# Altium schematic sheet usb_dc_converter.SchDoc
size 400 x 379 mm; SheetNumber: 2; SheetTotal: 13
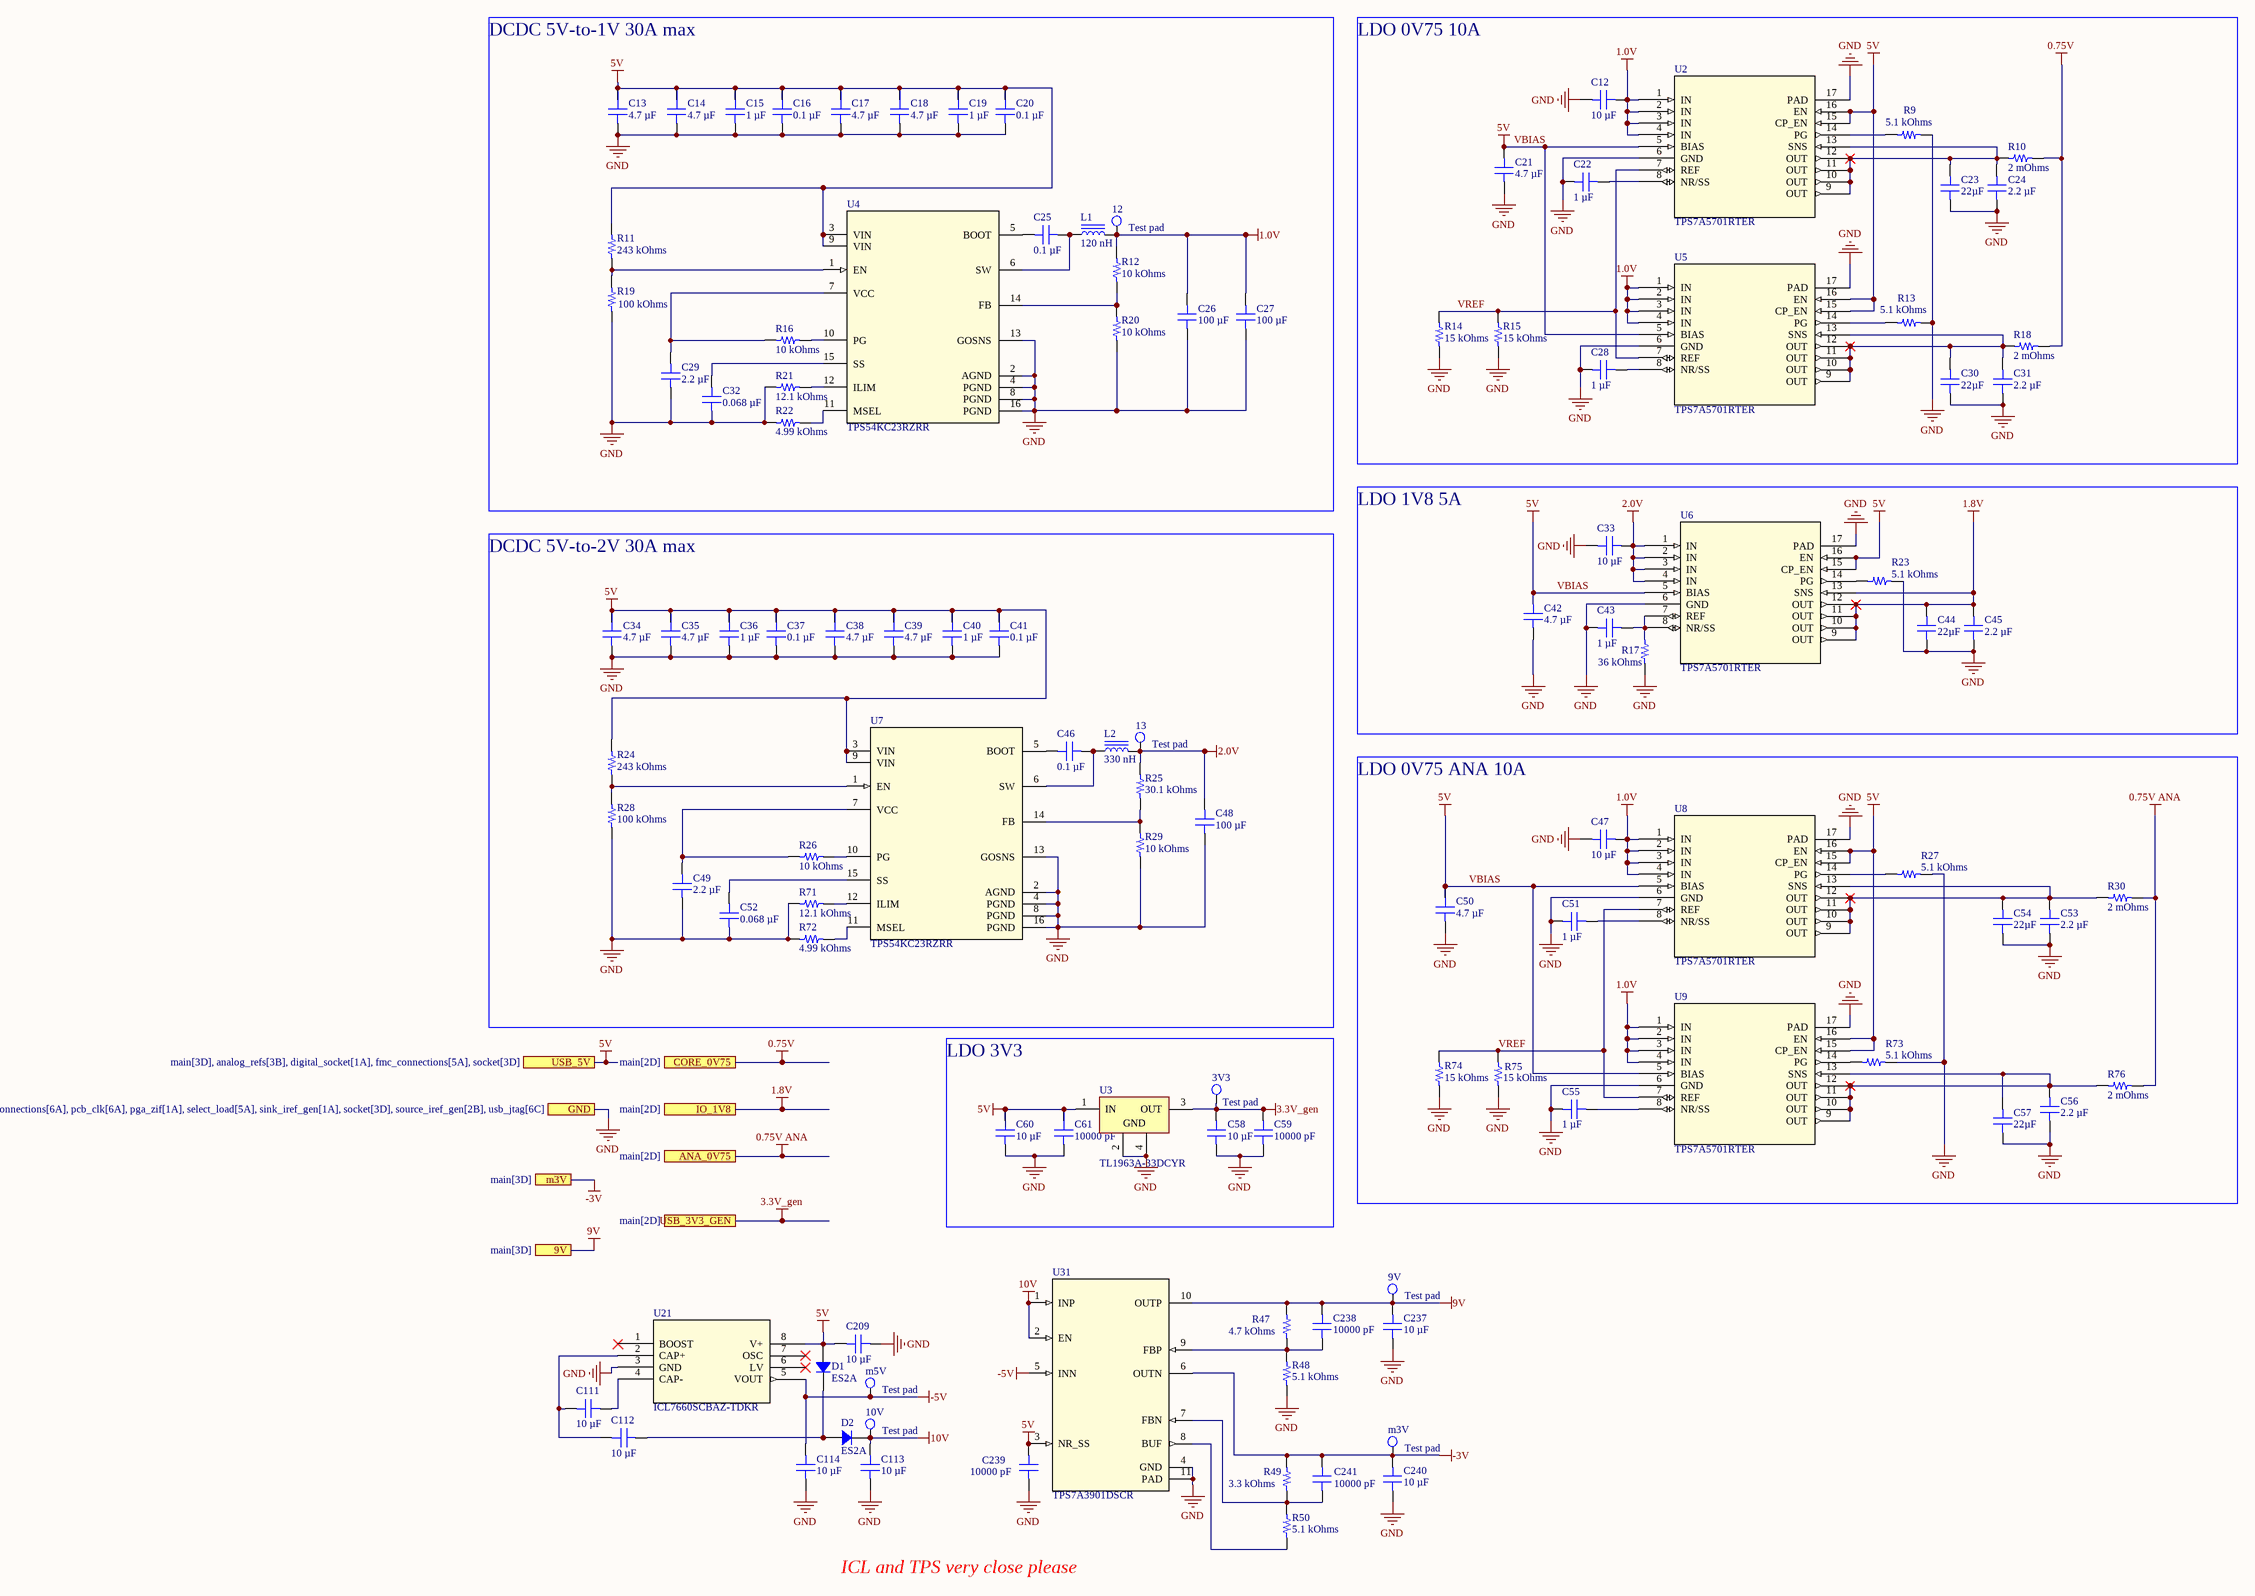
[diagram p0: usb_dc_converter.SchDoc]

## Parts
3V3  Test pad  [Test Pad]
9V  Test pad  [Test Pad]
10V  Test pad  [Test Pad]
12  Test pad  [Test Pad]
13  Test pad  [Test Pad]
C12  10 µF  [CAP 0805_2012]
C13  4.7 µF  [CAP 0805_2012]
C14  4.7 µF  [CAP 0805_2012]
C15  1 µF  [CAP 0805_2012]
C16  0.1 µF  [CAP 0805_2012]
C17  4.7 µF  [CAP 0805_2012]
C18  4.7 µF  [CAP 0805_2012]
C19  1 µF  [CAP 0805_2012]
C20  0.1 µF  [CAP 0805_2012]
C21  4.7 µF  [CAP 0805_2012]
C22  1 µF  [CAP 0805_2012]
C23  22µF  [CAP 0805_2012]
C24  2.2 µF  [CAP 0805_2012]
C25  0.1 µF  [CAP 0805_2012]
C26  100 µF  [CAP 0805_2012]
C27  100 µF  [CAP 0805_2012]
C28  1 µF  [CAP 0805_2012]
C29  2.2 µF  [CAP 0805_2012]
C30  22µF  [CAP 0805_2012]
C31  2.2 µF  [CAP 0805_2012]
C32  0.068 µF  [CAP 0805_2012]
C33  10 µF  [CAP 0805_2012]
C34  4.7 µF  [CAP 0805_2012]
C35  4.7 µF  [CAP 0805_2012]
C36  1 µF  [CAP 0805_2012]
C37  0.1 µF  [CAP 0805_2012]
C38  4.7 µF  [CAP 0805_2012]
C39  4.7 µF  [CAP 0805_2012]
C40  1 µF  [CAP 0805_2012]
C41  0.1 µF  [CAP 0805_2012]
C42  4.7 µF  [CAP 0805_2012]
C43  1 µF  [CAP 0805_2012]
C44  22µF  [CAP 0805_2012]
C45  2.2 µF  [CAP 0805_2012]
C46  0.1 µF  [CAP 0805_2012]
C47  10 µF  [CAP 0805_2012]
C48  100 µF  [CAP 0805_2012]
C49  2.2 µF  [CAP 0805_2012]
C50  4.7 µF  [CAP 0805_2012]
C51  1 µF  [CAP 0805_2012]
C52  0.068 µF  [CAP 0805_2012]
C53  2.2 µF  [CAP 0805_2012]
C54  22µF  [CAP 0805_2012]
C55  1 µF  [CAP 0805_2012]
C56  2.2 µF  [CAP 0805_2012]
C57  22µF  [CAP 0805_2012]
C58  10 µF  [CAP 0805_2012]
C59  10000 pF  [CAP 0805_2012]
C60  10 µF  [CAP 0805_2012]
C61  10000 pF  [CAP 0805_2012]
C111  10 µF  [CAP 0805_2012]
C112  10 µF  [CAP 0805_2012]
C113  10 µF  [CAP 0805_2012]
C114  10 µF  [CAP 0805_2012]
C209  10 µF  [CAP 0805_2012]
C237  10 µF  [CAP 0805_2012]
C238  10000 pF  [CAP 0805_2012]
C239  10000 pF  [CAP 0805_2012]
C240  10 µF  [CAP 0805_2012]
C241  10000 pF  [CAP 0805_2012]
D1  ES2A  [DO214AA SMB]
D2  ES2A  [DO214AA SMB]
L1  120 nH  [IND 0201_0603]
L2  330 nH  [Murata LQW15 0402]
m3V  Test pad  [Test Pad]
m5V  Test pad  [Test Pad]
R9  5.1 kOhms  [RES 0805_2012]
R10  2 mOhms  [RES 0805_2012]
R11  243 kOhms  [RES 0805_2012]
R12  10 kOhms  [RES 0805_2012]
R13  5.1 kOhms  [RES 0805_2012]
R14  15 kOhms  [RES 0805_2012]
R15  15 kOhms  [RES 0805_2012]
R16  10 kOhms  [RES 0805_2012]
R17  36 kOhms  [RES 0805_2012]
R18  2 mOhms  [RES 0805_2012]
R19  100 kOhms  [RES 0805_2012]
R20  10 kOhms  [RES 0805_2012]
R21  12.1 kOhms  [RES 0805_2012]
R22  4.99 kOhms  [RES 0805_2012]
R23  5.1 kOhms  [RES 0805_2012]
R24  243 kOhms  [RES 0805_2012]
R25  30.1 kOhms  [RES 0805_2012]
R26  10 kOhms  [RES 0805_2012]
R27  5.1 kOhms  [RES 0805_2012]
R28  100 kOhms  [RES 0805_2012]
R29  10 kOhms  [RES 0805_2012]
R30  2 mOhms  [RES 0805_2012]
R47  4.7 kOhms  [YAGEO RES 0805_2012]
R48  5.1 kOhms  [RES 0805_2012]
R49  3.3 kOhms  [YAGEO RES 0805_2012]
R50  5.1 kOhms  [RES 0805_2012]
R71  12.1 kOhms  [RES 0805_2012]
R72  4.99 kOhms  [RES 0805_2012]
R73  5.1 kOhms  [RES 0805_2012]
R74  15 kOhms  [RES 0805_2012]
R75  15 kOhms  [RES 0805_2012]
R76  2 mOhms  [RES 0805_2012]
U2  TPS7A5701RTER  [WQFN16_RTE_TEX_THERMAL]
U3  TL1963A-33DCYR  [DCY0004A_N]
U4  TPS54KC23RZRR  [RZR0016A-MFG_THERMAL]
U5  TPS7A5701RTER  [WQFN16_RTE_TEX_THERMAL]
U6  TPS7A5701RTER  [WQFN16_RTE_TEX_THERMAL]
U7  TPS54KC23RZRR  [RZR0016A-MFG_THERMAL]
U8  TPS7A5701RTER  [WQFN16_RTE_TEX_THERMAL]
U9  TPS7A5701RTER  [WQFN16_RTE_TEX_THERMAL]
U21  ICL7660SCBAZ-TDKR  [SOIC8_4X5_INR]
U31  TPS7A3901DSCR  [DSC0010J]

## Blocks framed on the sheet
DCDC 5V-to-1V 30A max: 12 C13-C20 C25-C27 C29 C32 L1 R11 R12 R16 R19-R22 U4
LDO 0V75 10A: C12 C21-C24 C28 C30 C31 R9 R10 R13-R15 R18 U2 U5
DCDC 5V-to-2V 30A max: 13 C34-C41 C46 C48 C49 C52 L2 R24-R26 R28 R29 R71 R72 U7
LDO 1V8 5A: C33 C42-C45 R17 R23 U6
LDO 0V75 ANA 10A: C47 C50 C51 C53-C57 R27 R30 R73-R76 U8 U9
LDO 3V3: 3V3 C58-C61 U3

## Ports
9V (see main[3D]), ANA_0V75 (see main[2D]), CORE_0V75 (see main[2D]), GND (see main[3D], analog_refs[3B], digital_socket[1A], fmc_connections[6A], pcb_clk[6A], pga_zif[1A], select_load[5A], sink_iref_gen[1A], socket[3D], source_iref_gen[2B], usb_jtag[6C]), IO_1V8 (see main[2D]), m3V (see main[3D]), USB_3V3_GEN (see main[2D]), USB_5V (see main[3D], analog_refs[3B], digital_socket[1A], fmc_connections[5A], socket[3D])

## Nets
0.75V: R10.2 R18.2 ; port CORE_0V75
0.75V ANA: R30.2 R76.2 ; port ANA_0V75
1.0V: 12.1 C12.1 C26.2 C27.2 C47.1 L1.2 R12.2 U2.1(IN) U2.2(IN) U2.3(IN) U2.4(IN) U5.1(IN) U5.2(IN) U5.3(IN) U5.4(IN) U8.1(IN) U8.2(IN) U8.3(IN) U8.4(IN) U9.1(IN) U9.2(IN) U9.3(IN) U9.4(IN)
1.8V: C44.2 C45.2 U6.9(OUT) U6.10(OUT) U6.11(OUT) U6.12(OUT) U6.13(SNS) ; port IO_1V8
2.0V: 13.1 C33.1 C48.2 L2.2 R25.2 U6.1(IN) U6.2(IN) U6.3(IN) U6.4(IN)
3.3V_gen: 3V3.1 C58.2 C59.2 U3.3(OUT) ; port USB_3V3_GEN
9V: 9V.1 C237.2 C238.2 R47.2 U31.10(OUTP) ; port 9V
10V: 10V.1 C113.2 D2.2 U31.1(INP) U31.2(EN)
-3V: C240.2 C241.2 m3V.1 R49.2 U31.6(OUTN) ; port m3V
-5V: C114.2 m5V.1 U21.5(VOUT) U31.5(INN)
GND: C12.2 C13.1 C14.1 C15.1 C16.1 C17.1 C18.1 C19.1 C20.1 C21.1 C22.2 C23.1 C24.1 C26.1 C27.1 C28.2 C29.1 C30.1 C31.1 C32.1 C33.2 C34.1 C35.1 C36.1 C37.1 C38.1 C39.1 C40.1 C41.1 C42.1 C43.2 C44.1 C45.1 C47.2 C48.1 C49.1 C50.1 C51.2 C52.1 C53.1 C54.1 C55.2 C56.1 C57.1 C58.1 C59.1 C60.1 C61.1 C113.1 C114.1 C209.1 C237.1 C239.1 C240.1 R9.1 R13.1 R14.1 R15.1 R17.1 R19.1 R20.1 R21.1 R22.1 R23.1 R27.1 R28.1 R29.1 R48.1 R71.1 R72.1 R73.1 R74.1 R75.1 U2.6(GND) U2.17(PAD) U3.2(GND) U3.4(GND) U4.2(AGND) U4.4(PGND) U4.8(PGND) U4.13(GOSNS) U4.16(PGND) U5.6(GND) U5.17(PAD) U6.6(GND) U6.17(PAD) U7.2(AGND) U7.4(PGND) U7.8(PGND) U7.13(GOSNS) U7.16(PGND) U8.6(GND) U8.17(PAD) U9.6(GND) U9.17(PAD) U21.3(GND) U31.4(GND) U31.11(PAD) ; port GND
VBIAS: C13.2 C14.2 C15.2 C16.2 C17.2 C18.2 C19.2 C20.2 C21.2 C34.2 C35.2 C36.2 C37.2 C38.2 C39.2 C40.2 C41.2 C42.2 C50.2 C60.2 C61.2 C209.2 C239.2 D1.1 R11.2 R24.2 U2.5(BIAS) U2.15(CP_EN) U2.16(EN) U3.1(IN) U4.3(VIN) U4.9(VIN) U5.5(BIAS) U5.15(CP_EN) U5.16(EN) U6.5(BIAS) U6.15(CP_EN) U6.16(EN) U7.3(VIN) U7.9(VIN) U8.5(BIAS) U8.15(CP_EN) U8.16(EN) U9.5(BIAS) U9.15(CP_EN) U9.16(EN) U21.8(V+) U31.3(NR_SS) ; port USB_5V  [also labelled 5V]
VREF: R14.2 R15.2 R74.2 R75.2 U2.7(REF) U5.7(REF) U8.7(REF) U9.7(REF)
NetC22_1: C22.1 U2.8(NR/SS)
NetC23_2: C23.2 C24.2 R10.1 U2.9(OUT) U2.10(OUT) U2.11(OUT) U2.12(OUT) U2.13(SNS)
NetC25_1: C25.1 L1.1 U4.6(SW)
NetC25_2: C25.2 U4.5(BOOT)
NetC28_1: C28.1 U5.8(NR/SS)
NetC29_2: C29.2 R16.1 U4.7(VCC)
NetC30_2: C30.2 C31.2 R18.1 U5.9(OUT) U5.10(OUT) U5.11(OUT) U5.12(OUT) U5.13(SNS)
NetC32_2: C32.2 U4.15(SS)
NetC43_1: C43.1 R17.2 U6.7(REF) U6.8(NR/SS)
NetC46_1: C46.1 L2.1 U7.6(SW)
NetC46_2: C46.2 U7.5(BOOT)
NetC49_2: C49.2 R26.2 U7.7(VCC)
NetC51_1: C51.1 U8.8(NR/SS)
NetC52_2: C52.2 U7.15(SS)
NetC53_2: C53.2 C54.2 R30.1 U8.9(OUT) U8.10(OUT) U8.11(OUT) U8.12(OUT) U8.13(SNS)
NetC55_1: C55.1 U9.8(NR/SS)
NetC56_2: C56.2 C57.2 R76.1 U9.9(OUT) U9.10(OUT) U9.11(OUT) U9.12(OUT) U9.13(SNS)
NetC111_1: C111.1 U21.4(CAP-)
NetC111_2: C111.2 C112.1 U21.2(CAP+)
NetC112_2: C112.2 D1.2 D2.1
NetC238_1: C238.1 R47.1 R48.2 U31.9(FBP)
NetC241_1: C241.1 R49.1 R50.2 U31.7(FBN)
NetR9_2: R9.2 U2.14(PG)
NetR11_1: R11.1 R19.2 U4.1(EN)
NetR12_1: R12.1 R20.2 U4.14(FB)
NetR13_2: R13.2 U5.14(PG)
NetR16_2: R16.2 U4.10(PG)
NetR21_2: R21.2 U4.12(ILIM)
NetR22_2: R22.2 U4.11(MSEL)
NetR23_2: R23.2 U6.14(PG)
NetR24_1: R24.1 R28.2 U7.1(EN)
NetR25_1: R25.1 R29.2 U7.14(FB)
NetR26_1: R26.1 U7.10(PG)
NetR27_2: R27.2 U8.14(PG)
NetR50_1: R50.1 U31.8(BUF)
NetR71_2: R71.2 U7.12(ILIM)
NetR72_2: R72.2 U7.11(MSEL)
NetR73_2: R73.2 U9.14(PG)

Not connected (* = marked no-connect by the designer): U21 1(BOOST)* 6(LV)* 7(OSC)*

## Notes on the sheet
- ICL and TPS very close please

## Library data of the parts
C12 C33 C47 C58 C60 C111-C114 C209 C237 C240 = 0805BW106K160NGT: CAP CER 10UF 16V X5R 0805; manufacturer: Knowles Novacap; Tolerance: ±10%; Part Number: 0805BW106K160NGT; Capacitance: 10 µF; Applications: SMPS Filtering; componentlink1description: Datasheet; componentlink1url: https://www.knowlescapacitors.com/getattachment/6c8d48ef-fc2b-4752-ae2c-ce6c208de0c4/High-Capacitance-Chip.aspx; componentlink2description: DigiKey Link; componentlink2url: https://www.digikey.com/en/products/detail/knowles-novacap/0805BW106K160NGT/7303991; Device Package: 0805 (2012 Metric); Features: Bonding Mountable, Gold Flash Termination; lastupdated: 4/6/2026 7:32:52 PM; Lifecycle Status: Active; Minimum Order: 1; Mounting Type: Surface Mount, MLCC, Epoxy; Operating Temperature: -55°C ~ 85°C; Package / Case: 0805 (2012 Metric); packaging: TapeAndReel; partid: 10571; Part Status: Active; price: 1.74; series: -; Size / Dimension: 0.080" L x 0.050" W (2.03mm x 1.27mm); Supplier 1: DigiKey; Supplier Part Number 1: 1763-1170-1-ND; Temperature Coefficient: X5R; Thickness (Max): 0.054" (1.37mm); value: 10 µF; Voltage - Rated: 16V
C13 C14 C17 C18 C21 C34 C35 C38 C39 C42 C50 = 0805B475K100CT: CAP CER 4.7UF 10V X7R 0805; manufacturer: Walsin Technology Corporation; Tolerance: ±10%; Part Number: 0805B475K100CT; Capacitance: 4.7 µF; Applications: General Purpose; componentlink1description: Datasheet; componentlink1url: https://www.passivecomponent.com/wp-content/uploads/datasheet/WTC_MLCC_General_Purpose.pdf; componentlink2description: DigiKey Link; componentlink2url: https://www.digikey.com/en/products/detail/walsin-technology-corporation/0805B475K100CT/15987965; Device Package: 0805 (2012 Metric); lastupdated: 4/6/2026 7:29:10 PM; Lifecycle Status: Active; Minimum Order: 1; Mounting Type: Surface Mount, MLCC; Operating Temperature: -55°C ~ 125°C; Package / Case: 0805 (2012 Metric); packaging: TapeAndReel; partid: 72231; price: 0.02; series: -; Size / Dimension: 0.079" L x 0.049" W (2.00mm x 1.25mm); Supplier 1: DigiKey; Supplier Part Number 1: 1292-0805B475K100CT-ND; Temperature Coefficient: X7R; Thickness (Max): 0.057" (1.45mm); value: 4.7 µF; Voltage - Rated: 10V
C15 C19 C22 C28 C36 C40 C43 C51 C55 = 0805B105K160CT: CAP CER 1UF 16V X7R 0805; manufacturer: Walsin Technology Corporation; Tolerance: ±10%; Part Number: 0805B105K160CT; Capacitance: 1 µF; Applications: General Purpose; componentlink1description: Datasheet; componentlink1url: https://www.passivecomponent.com/wp-content/uploads/datasheet/WTC_MLCC_General_Purpose.pdf; componentlink2description: DigiKey Link; componentlink2url: https://www.digikey.com/en/products/detail/walsin-technology-corporation/0805B105K160CT/6707557; Device Package: 0805 (2012 Metric); lastupdated: 4/6/2026 7:31:51 PM; Lifecycle Status: Active; Minimum Order: 1; Mounting Type: Surface Mount, MLCC; Operating Temperature: -55°C ~ 125°C; Package / Case: 0805 (2012 Metric); packaging: TapeAndReel; partid: 39843; Part Status: Active; price: 0.01; series: -; Size / Dimension: 0.079" L x 0.049" W (2.00mm x 1.25mm); Supplier 1: DigiKey; Supplier Part Number 1: 1292-0805B105K160CT-ND; Temperature Coefficient: X7R; Thickness (Max): 0.053" (1.35mm); value: 1 µF; Voltage - Rated: 16V
C16 C20 C25 C37 C41 C46 = 160R15W104KV4T: CAP CER 0.1UF 16V X7R 0805; manufacturer: Johanson Dielectrics Inc.; Tolerance: ±10%; Part Number: 160R15W104KV4T; Capacitance: 0.1 µF; Applications: General Purpose; componentlink1description: Datasheet; componentlink1url: https://www.johansondielectrics.com/downloads/catalog/johanson-dielectrics-product-catalog.pdf; componentlink2description: DigiKey Link; componentlink2url: https://www.digikey.com/en/products/detail/johanson-dielectrics-inc/160R15W104KV4T/1859428; Device Package: 0805 (2012 Metric); lastupdated: 4/6/2026 7:32:57 PM; Lifecycle Status: Active; Minimum Order: 1; Mounting Type: Surface Mount, MLCC; Operating Temperature: -55°C ~ 125°C; Package / Case: 0805 (2012 Metric); packaging: TapeAndReel; partid: 9125; Part Status: Active; price: 0.03; series: -; Size / Dimension: 0.080" L x 0.050" W (2.03mm x 1.27mm); Supplier 1: DigiKey; Supplier Part Number 1: 709-1183-1-ND; Temperature Coefficient: X7R; Thickness (Max): 0.050" (1.27mm); value: 0.1 µF; Voltage - Rated: 16V
C23 C30 C44 C54 C57 = 08056D226KAT2A: CAP CER 22UF 6.3V X5R 0805; manufacturer: AVX Corporation; Tolerance: ±10%; Part Number: 08056D226KAT2A; Capacitance: 22µF; Applications: General Purpose; componentlink1description: Datasheet; componentlink1url: http://datasheets.avx.com/cx5r.pdf; componentlink2description: DigiKey Link; componentlink2url: http://digikey.com/product-detail/en/avx-corporation/08056D226KAT2A/478-10069-1-ND/6564291; Device Package: 0805 (2012 Metric); lastupdated: 9/2/2020 1:04:40 AM; Lifecycle Status: Active; Minimum Order: 1; Mounting Type: Surface Mount, MLCC; Operating Temperature: -55°C ~ 85°C; Package / Case: 0805 (2012 Metric); packaging: TapeAndReel; partid: 3404; Part Status: Active; price: 0.18; series: -; Size / Dimension: 0.079" L x 0.049" W (2.01mm x 1.25mm); Supplier 1: DigiKey; Supplier Part Number 1: 478-10069-1-ND; Temperature Coefficient: X5R; Thickness (Max): 0.060" (1.52mm); value: 22µF; Voltage - Rated: 6.3V
C24 C29 C31 C45 C49 C53 C56 = 0805B225K250CT: CAP CER 2.2UF 25V X7R 0805; manufacturer: Walsin Technology Corporation; Tolerance: ±10%; Part Number: 0805B225K250CT; Capacitance: 2.2 µF; Applications: General Purpose; componentlink1description: Datasheet; componentlink1url: https://www.passivecomponent.com/wp-content/uploads/datasheet/WTC_MLCC_General_Purpose.pdf; componentlink2description: DigiKey Link; componentlink2url: https://www.digikey.com/en/products/detail/walsin-technology-corporation/0805B225K250CT/14836806; Device Package: 0805 (2012 Metric); lastupdated: 4/6/2026 7:31:50 PM; Lifecycle Status: Active; Minimum Order: 1; Mounting Type: Surface Mount, MLCC; Operating Temperature: -55°C ~ 125°C; Package / Case: 0805 (2012 Metric); packaging: TapeAndReel; partid: 40661; Part Status: Active; price: 0.01; series: -; Size / Dimension: 0.079" L x 0.049" W (2.00mm x 1.25mm); Supplier 1: DigiKey; Supplier Part Number 1: 1292-0805B225K250CT-ND; Temperature Coefficient: X7R; Thickness (Max): 0.057" (1.45mm); value: 2.2 µF; Voltage - Rated: 25V
C26 C27 C48 = AMK212BBJ107MG-TE: CAP CER 100UF 4V X5R 0805; manufacturer: Taiyo Yuden; Tolerance: ±20%; Part Number: AMK212BBJ107MG-TE; Capacitance: 100 µF; Applications: SMPS Filtering; componentlink1description: Datasheet; componentlink1url: https://mm.digikey.com/Volume0/opasdata/d220001/medias/docus/421/AMK212BBJ107MG-TE_SS.pdf; componentlink2description: DigiKey Link; componentlink2url: https://www.digikey.com/en/products/detail/taiyo-yuden/AMK212BBJ107MG-TE/11675691; Device Package: 0805 (2012 Metric); lastupdated: 4/6/2026 7:29:11 PM; Lifecycle Status: Active; Minimum Order: 1; Mounting Type: Surface Mount, MLCC; Operating Temperature: -55°C ~ 85°C; Package / Case: 0805 (2012 Metric); packaging: TapeAndReel; partid: 72301; price: 0.44; series: M; Size / Dimension: 0.079" L x 0.049" W (2.00mm x 1.25mm); Supplier 1: DigiKey; Supplier Part Number 1: 587-AMK212BBJ107MG-TECT-ND; Temperature Coefficient: X5R; Thickness (Max): 0.057" (1.45mm); value: 100 µF; Voltage - Rated: 4V
C32 C52 = C0805C683J1REC7210: CAP CER 0805 68NF 100V X7R 5%; manufacturer: KEMET; Part Number: C0805C683J1REC7210; Capacitance: 0.068 µF; Applications: ESD Protection; componentlink1description: Datasheet; componentlink1url: https://connect.kemet.com:7667/gateway/IntelliData-ComponentDocumentation/1.0/download/datasheet/C0805C683J1REC7210; componentlink2description: DigiKey Link; componentlink2url: https://www.digikey.com/en/products/detail/kemet/C0805C683J1REC7210/8645206; Device Package: 0805 (2012 Metric); lastupdated: 4/6/2026 7:31:29 PM; Lifecycle Status: Active; Minimum Order: 1; Mounting Type: Surface Mount, MLCC; Operating Temperature: -55°C ~ 125°C; Package / Case: 0805 (2012 Metric); packaging: TapeAndReel; partid: 48814; Part Status: Active; price: 0.04; series: ESD SMD Comm X7R; Size / Dimension: 0.079" L x 0.049" W (2.00mm x 1.25mm); Supplier 1: DigiKey; Supplier Part Number 1: 399-C0805C683J1REC7210CT-ND; Temperature Coefficient: X7R; Thickness (Max): 0.043" (1.10mm); Tolerance: ±5%; value: 0.068 µF; Voltage - Rated: 100V
C59 C61 C239 = C0805C103F1GECAUTO: CAP CER 0805 10NF 100V C0G 1%; manufacturer: KEMET; Temperature Coefficient: C0G, NP0; Part Number: C0805C103F1GECAUTO; Capacitance: 10000 pF; Applications: Automotive, ESD Protection; componentlink1description: Datasheet; componentlink1url: https://connect.kemet.com:7667/gateway/IntelliData-ComponentDocumentation/1.0/download/datasheet/C0805C103F1GECAUTO; componentlink2description: DigiKey Link; componentlink2url: https://www.digikey.com/en/products/detail/kemet/C0805C103F1GECAUTO/8647293; Device Package: 0805 (2012 Metric); Features: Low ESL, Low ESR; lastupdated: 4/6/2026 7:31:32 PM; Lifecycle Status: Active; Minimum Order: 1; Mounting Type: Surface Mount, MLCC; Operating Temperature: -55°C ~ 125°C; Package / Case: 0805 (2012 Metric); packaging: TapeAndReel; partid: 49035; Part Status: Active; price: 0.47; Ratings: AEC-Q200; series: ESD SMD Auto C0G; Size / Dimension: 0.079" L x 0.049" W (2.00mm x 1.25mm); Supplier 1: DigiKey; Supplier Part Number 1: 399-C0805C103F1GECAUTOCT-ND; Thickness (Max): 0.039" (1.00mm); Tolerance: ±1%; value: 10000 pF; Voltage - Rated: 100V
C238 C241 = C0805C103J4RECAUTO7210: CAP CER 0805 10NF 16V X7R 5%; manufacturer: KEMET; Part Number: C0805C103J4RECAUTO7210; Capacitance: 10000 pF; Applications: Automotive, ESD Protection; componentlink1description: Datasheet; componentlink1url: https://connect.kemet.com:7667/gateway/IntelliData-ComponentDocumentation/1.0/download/datasheet/C0805C103J4RECAUTO7210; componentlink2description: DigiKey Link; componentlink2url: https://www.digikey.com/en/products/detail/kemet/C0805C103J4RECAUTO7210/8647961; Device Package: 0805 (2012 Metric); lastupdated: 4/6/2026 7:31:41 PM; Lifecycle Status: Active; Minimum Order: 1; Mounting Type: Surface Mount, MLCC; Operating Temperature: -55°C ~ 125°C; Package / Case: 0805 (2012 Metric); packaging: TapeAndReel; partid: 47286; Part Status: Active; price: 0.05; Ratings: AEC-Q200; series: ESD SMD Auto X7R; Size / Dimension: 0.079" L x 0.049" W (2.00mm x 1.25mm); Supplier 1: DigiKey; Supplier Part Number 1: 399-C0805C103J4RECAUTO7210CT-ND; Temperature Coefficient: X7R; Thickness (Max): 0.035" (0.88mm); Tolerance: ±5%; value: 10000 pF; Voltage - Rated: 16V
D1 D2 = ES2A: DIODE GEN PURP 50V 2A DO214AA; Manufacturer: ON Semiconductor; Capacitance @ Vr, F: 18pF @ 4V, 1MHz; Current - Reverse Leakage @ Vr: 10µA @ 50V; Diode Type: Standard; Reverse Recovery Time (trr): 20ns; Speed: Fast Recovery =< 500ns, > 200mA (Io); Voltage - Forward (Vf) (Max) @ If: 900mV @ 2A; Part Number: ES2A; ComponentLink1Description: Datasheet; ComponentLink1URL: https://www.onsemi.com/pub/Collateral/ES2D-D.pdf; ComponentLink2Description: DigiKey Link; ComponentLink2URL: http://digikey.com/product-detail/en/on-semiconductor/ES2A/ES2AFSCT-ND/3042548; Current - Average Rectified (Io): 2A; LastUpdated: 4/5/2026 8:31:04 PM; Lifecycle Status: Active; Minimum Order: 1; Mounting Type: Surface Mount; Operating Temperature - Junction: -55°C ~ 150°C; Package / Case: DO-214AA, SMB; Packaging: TapeAndReel; PartId: 120; Part Status: Active; Price: 0.12; Series: -; Supplier 1: DigiKey; Supplier Part Number 1: ES2AFSCT-ND; Supplier Device Package: DO-214AA (SMB); Voltage - DC Reverse (Vr) (Max): 50V
L1 = LQP03TNR12J02D: FIXED IND 120NH 40MA 12 OHM SMD; Manufacturer: Murata Electronics; Current Rating (Amps): 80 mA; DC Resistance (DCR): 12Ohm Max; Frequency - Self Resonant: 800MHz; Inductance Frequency - Test: 300 MHz; Material - Core: Non-Magnetic; Q @ Freq: 8 @ 300MHz; Shielding: Unshielded; Tolerance: ±5%; Type: Thick Film; Part Number: LQP03TNR12J02D; ComponentLink1Description: Datasheet; ComponentLink1URL: https://search.murata.co.jp/Ceramy/image/img/P02/JELF243C-0015.pdf; ComponentLink2Description: DigiKey Link; ComponentLink2URL: https://www.digikey.com/en/products/detail/murata-electronics/LQP03TNR12J02D/2391767; Device Package: 0201 (0603 Metric); Height - Seated (Max): 0.013" (0.33mm); Inductance: 120 nH; LastUpdated: 4/5/2026 8:47:40 PM; Lifecycle Status: Active; Minimum Order: 1; Mounting Type: Surface Mount; Operating Temperature: -55°C ~ 125°C; Package / Case: 0201 (0603 Metric); Packaging: TapeAndReel; PartId: 615; Part Status: Active; Price: 0.01; Series: LQP03; Size / Dimension: 0.024" L x 0.012" W (0.60mm x 0.30mm); Supplier 1: DigiKey; Supplier Part Number 1: 490-8430-1-ND; Supplier Device Package: 0201 (0603 Metric); Value: 120 nH
L2 = LQW15CNR33J10D: FIXED IND 330NH 390MA 0.56OHM SM; Manufacturer: Murata Electronics; DC Resistance (DCR): 560mOhm Max; Frequency - Self Resonant: 520MHz; Inductance Frequency - Test: 100 MHz; Material - Core: Ferrite; Shielding: Unshielded; Tolerance: ±5%; Type: Drum Core, Wirewound; Part Number: LQW15CNR33J10D; ComponentLink1Description: Datasheet; ComponentLink1URL: https://search.murata.co.jp/Ceramy/image/img/P02/JELF243A-0096.pdf; ComponentLink2Description: DigiKey Link; ComponentLink2URL: https://www.digikey.com/en/products/detail/murata-electronics/LQW15CNR33J10D/4906006; Current Rating (Amps): 390 mA; Device Package: 0402 (1005 Metric); Height - Seated (Max): 0.024" (0.60mm); Inductance: 330 nH; LastUpdated: 4/5/2026 9:07:19 PM; Lifecycle Status: Active; Minimum Order: 1; Mounting Type: Surface Mount; Operating Temperature: -55°C ~ 125°C; Package / Case: 0402 (1005 Metric); Packaging: TapeAndReel; PartId: 435; Part Status: Active; Price: 0.17; Series: LQW15; Size / Dimension: 0.039" L x 0.024" W (1.00mm x 0.60mm); Supplier 1: DigiKey; Supplier Part Number 1: 490-16892-1-ND; Value: 330 nH
R9 R13 R23 R27 R48 R50 R73 = 560112120019: RES 5.1K OHM 5% 1/4W 0805; Manufacturer: Würth Elektronik; Power (Watts): 0.25W, 1/4W; Temperature Coefficient: ±100ppm/°C; Part Number: 560112120019; Value: 5.1 kOhms; ComponentLink1Description: Datasheet; ComponentLink1URL: https://www.we-online.com/katalog/datasheet/560112120019.pdf; ComponentLink2Description: DigiKey Link; ComponentLink2URL: https://www.digikey.com/en/products/detail/würth-elektronik/560112120019/22230497; Composition: Thick Film; Device Package: 0805 (2012 Metric); Features: Anti-Sulfur; Height - Seated (Max): 0.026" (0.65mm); LastUpdated: 4/6/2026 8:09:43 PM; Lifecycle Status: Active; Minimum Order: 1; Number of Terminations: 2; Operating Temperature: -55°C ~ 155°C; Package / Case: 0805 (2012 Metric); Packaging: TapeAndReel; PartId: 95975; Price: 0.03; Resistance: 5.1 kOhms; Series: WRIS-RSKS; Size / Dimension: 0.079" L x 0.049" W (2.00mm x 1.25mm); Supplier 1: DigiKey; Supplier Part Number 1: 732-560112120019CT-ND; Supplier Device Package: 0805; Tolerance: ±5%
R10 R18 R30 R76 = CSSH0805FT2L00: RES 0.002 OHM 1% 1W 0805; Manufacturer: Stackpole Electronics Inc; Temperature Coefficient: ±100ppm/°C; Part Number: CSSH0805FT2L00; Value: 2 mOhms; ComponentLink2Description: DigiKey Link; ComponentLink2URL: https://www.digikey.com/en/products/detail/stackpole-electronics-inc/CSSH0805FT2L00/10719360; Composition: Metal Element; Device Package: 0805 (2012 Metric); Features: Automotive AEC-Q200, Current Sense; Height - Seated (Max): 0.026" (0.67mm); LastUpdated: 4/5/2026 8:09:20 PM; Lifecycle Status: Active; Minimum Order: 1; Number of Terminations: 2; Operating Temperature: -55°C ~ 170°C; Package / Case: 0805 (2012 Metric); Packaging: TapeAndReel; PartId: 50073; Part Status: Active; Power (Watts): 1W; Price: 0.13; Ratings: AEC-Q200; Resistance: 2 mOhms; Series: CSSH; Size / Dimension: 0.083" L x 0.059" W (2.10mm x 1.50mm); Supplier 1: DigiKey; Supplier Part Number 1: 738-CSSH0805FT2L00CT-ND; Supplier Device Package: 0805; Tolerance: ±1%
R11 R24 = 3-2176094-0: RES SMD 243K OHM 0.1% 1/4W 0805; Manufacturer: TE Connectivity Passive Product; Power (Watts): 0.25W, 1/4W; Temperature Coefficient: ±25ppm/°C; Part Number: 3-2176094-0; Value: 243 kOhms; ComponentLink1Description: Datasheet; ComponentLink1URL: https://www.te.com/commerce/DocumentDelivery/DDEController?Action=srchrtrv&DocNm=1773272&DocType=DS&DocLang=English; ComponentLink2Description: DigiKey Link; ComponentLink2URL: https://www.digikey.com/en/products/detail/te-connectivity-passive-product/3-2176094-0/4034240; Composition: Thin Film; Device Package: 0805 (2012 Metric); Height - Seated (Max): 0.026" (0.65mm); LastUpdated: 4/5/2026 8:09:55 PM; Lifecycle Status: Active; Minimum Order: 1; Number of Terminations: 2; Operating Temperature: -55°C ~ 155°C; Package / Case: 0805 (2012 Metric); Packaging: TapeAndReel; PartId: 46793; Part Status: Active; Price: 0.17; Resistance: 243 kOhms; Series: RP73P, Holsworthy; Size / Dimension: 0.079" L x 0.049" W (2.00mm x 1.25mm); Supplier 1: DigiKey; Supplier Part Number 1: A110772CT-ND; Supplier Device Package: 0805; Tolerance: ±0.1%
R12 R16 R20 R26 R29 = 9-2176375-1: RES 10K OHM 0.1% 1/5W 0805; Manufacturer: TE Connectivity Passive Product; Power (Watts): 0.2W, 1/5W; Temperature Coefficient: ±10ppm/°C; Part Number: 9-2176375-1; Value: 10 kOhms; ComponentLink1Description: Datasheet; ComponentLink1URL: https://www.te.com/usa-en/product-9-2176375-1.datasheet.pdf; ComponentLink2Description: DigiKey Link; ComponentLink2URL: https://www.digikey.com/en/products/detail/te-connectivity-passive-product/9-2176375-1/18110542; Composition: Thin Film; Device Package: 0805 (2012 Metric); Features: Anti-Sulfur, Automotive AEC-Q200, Moisture Resistant; Height - Seated (Max): 0.026" (0.65mm); LastUpdated: 4/5/2026 8:08:39 PM; Lifecycle Status: Active; Minimum Order: 1; Number of Terminations: 2; Operating Temperature: -55°C ~ 155°C; Package / Case: 0805 (2012 Metric); Packaging: TapeAndReel; PartId: 76290; Part Status: Active; Price: 0.35; Ratings: AEC-Q200; Resistance: 10 kOhms; Series: RQ73; Size / Dimension: 0.079" L x 0.049" W (2.00mm x 1.25mm); Supplier 1: DigiKey; Supplier Part Number 1: 1712-9-2176375-1CT-ND; Supplier Device Package: 0805; Tolerance: ±0.1%
R14 R15 R74 R75 = 2-2176093-0: RES SMD 15K OHM 0.1% 1/4W 0805; Manufacturer: TE Connectivity Passive Product; Power (Watts): 0.25W, 1/4W; Temperature Coefficient: ±25ppm/°C; Part Number: 2-2176093-0; Value: 15 kOhms; ComponentLink1Description: Datasheet; ComponentLink1URL: https://www.te.com/commerce/DocumentDelivery/DDEController?Action=srchrtrv&DocNm=1773272&DocType=DS&DocLang=English; ComponentLink2Description: DigiKey Link; ComponentLink2URL: https://www.digikey.com/en/products/detail/te-connectivity-passive-product/2-2176093-0/4034124; Composition: Thin Film; Device Package: 0805 (2012 Metric); Height - Seated (Max): 0.026" (0.65mm); LastUpdated: 4/5/2026 8:10:12 PM; Lifecycle Status: Active; Minimum Order: 1; Number of Terminations: 2; Operating Temperature: -55°C ~ 155°C; Package / Case: 0805 (2012 Metric); Packaging: TapeAndReel; PartId: 44076; Part Status: Active; Price: 0.14; Resistance: 15 kOhms; Series: RP73P, Holsworthy; Size / Dimension: 0.079" L x 0.049" W (2.00mm x 1.25mm); Supplier 1: DigiKey; Supplier Part Number 1: A110656CT-ND; Supplier Device Package: 0805; Tolerance: ±0.1%
R17 = 3430A2F36KTDF: 3430 A2 1% 36K 100PPM 1K RL; Manufacturer: TE Connectivity Passive Product; Power (Watts): 1W; Temperature Coefficient: ±100ppm/°C; Part Number: 3430A2F36KTDF; Value: 36 kOhms; ComponentLink2Description: DigiKey Link; ComponentLink2URL: https://www.digikey.com/en/products/detail/te-connectivity-passive-product/3430A2F36KTDF/17763376; Composition: Thick Film; Device Package: 0805 (2012 Metric); Features: Automotive AEC-Q200; Height - Seated (Max): 0.026" (0.65mm); LastUpdated: 4/5/2026 8:08:39 PM; Lifecycle Status: Active; Minimum Order: 1; Number of Terminations: 2; Operating Temperature: -55°C ~ 155°C; Package / Case: 0805 (2012 Metric); Packaging: TapeAndReel; PartId: 76291; Part Status: Active; Price: 0.02; Ratings: AEC-Q200; Resistance: 36 kOhms; Series: 3430; Size / Dimension: 0.049" L x 0.079" W (1.25mm x 2.00mm); Supplier 1: DigiKey; Supplier Part Number 1: 1712-3430A2F36KTDFCT-ND; Supplier Device Package: 0508; Tolerance: ±1%
R19 R28 = 3430A2F100KTDF: 3430 A2 1% 100K 100PPM 1K RL; Manufacturer: TE Connectivity Passive Product; Power (Watts): 1W; Temperature Coefficient: ±100ppm/°C; Part Number: 3430A2F100KTDF; Value: 100 kOhms; ComponentLink1Description: Datasheet; ComponentLink1URL: https://www.te.com/usa-en/product-4-2176559-1.datasheet.pdf; ComponentLink2Description: DigiKey Link; ComponentLink2URL: https://www.digikey.com/en/products/detail/te-connectivity-passive-product/3430A2F100KTDF/17763668; Composition: Thick Film; Device Package: 0805 (2012 Metric); Features: Automotive AEC-Q200; Height - Seated (Max): 0.026" (0.65mm); LastUpdated: 4/5/2026 8:08:27 PM; Lifecycle Status: Active; Minimum Order: 1; Number of Terminations: 2; Operating Temperature: -55°C ~ 155°C; Package / Case: 0805 (2012 Metric); Packaging: TapeAndReel; PartId: 78438; Part Status: Active; Price: 0.02; Ratings: AEC-Q200; Resistance: 100 kOhms; Series: 3430; Size / Dimension: 0.049" L x 0.079" W (1.25mm x 2.00mm); Supplier 1: DigiKey; Supplier Part Number 1: 1712-3430A2F100KTDFCT-ND; Supplier Device Package: 0508; Tolerance: ±1%
R21 R71 = 1-2176093-2: RES SMD 12.1K OHM 0.1% 1/4W 0805; Manufacturer: TE Connectivity Passive Product; Power (Watts): 0.25W, 1/4W; Temperature Coefficient: ±25ppm/°C; Part Number: 1-2176093-2; Value: 12.1 kOhms; ComponentLink1Description: Datasheet; ComponentLink1URL: https://www.te.com/commerce/DocumentDelivery/DDEController?Action=srchrtrv&DocNm=1773272&DocType=DS&DocLang=English; ComponentLink2Description: DigiKey Link; ComponentLink2URL: https://www.digikey.com/en/products/detail/te-connectivity-passive-product/1-2176093-2/4034115; Composition: Thin Film; Device Package: 0805 (2012 Metric); Height - Seated (Max): 0.026" (0.65mm); LastUpdated: 4/5/2026 8:09:25 PM; Lifecycle Status: Active; Minimum Order: 1; Number of Terminations: 2; Operating Temperature: -55°C ~ 155°C; Package / Case: 0805 (2012 Metric); Packaging: TapeAndReel; PartId: 49448; Part Status: Active; Price: 0.15; Resistance: 12.1 kOhms; Series: RP73P, Holsworthy; Size / Dimension: 0.079" L x 0.049" W (2.00mm x 1.25mm); Supplier 1: DigiKey; Supplier Part Number 1: A110647CT-ND; Supplier Device Package: 0805; Tolerance: ±0.1%
R22 R72 = 7-2176092-8: RES SMD 4.99K OHM 0.1% 1/4W 0805; Manufacturer: TE Connectivity Passive Product; Power (Watts): 0.25W, 1/4W; Temperature Coefficient: ±25ppm/°C; Part Number: 7-2176092-8; Value: 4.99 kOhms; ComponentLink1Description: Datasheet; ComponentLink1URL: https://www.te.com/commerce/DocumentDelivery/DDEController?Action=srchrtrv&DocNm=1773272&DocType=DS&DocLang=English; ComponentLink2Description: DigiKey Link; ComponentLink2URL: https://www.digikey.com/en/products/detail/te-connectivity-passive-product/7-2176092-8/4034078; Composition: Thin Film; Device Package: 0805 (2012 Metric); Height - Seated (Max): 0.026" (0.65mm); LastUpdated: 4/5/2026 8:10:59 PM; Lifecycle Status: Active; Minimum Order: 1; Number of Terminations: 2; Operating Temperature: -55°C ~ 155°C; Package / Case: 0805 (2012 Metric); Packaging: TapeAndReel; PartId: 34159; Part Status: Active; Price: 0.14; Resistance: 4.99 kOhms; Series: RP73P, Holsworthy; Size / Dimension: 0.079" L x 0.049" W (2.00mm x 1.25mm); Supplier 1: DigiKey; Supplier Part Number 1: A110610CT-ND; Supplier Device Package: 0805; Tolerance: ±0.1%
R25 = 4-2176093-8: RES SMD 30.1K OHM 0.1% 1/4W 0805; Manufacturer: TE Connectivity Passive Product; Power (Watts): 0.25W, 1/4W; Temperature Coefficient: ±25ppm/°C; Part Number: 4-2176093-8; Value: 30.1 kOhms; ComponentLink1Description: Datasheet; ComponentLink1URL: https://www.te.com/commerce/DocumentDelivery/DDEController?Action=srchrtrv&DocNm=1773272&DocType=DS&DocLang=English; ComponentLink2Description: DigiKey Link; ComponentLink2URL: https://www.digikey.com/en/products/detail/te-connectivity-passive-product/4-2176093-8/4034153; Composition: Thin Film; Device Package: 0805 (2012 Metric); Height - Seated (Max): 0.026" (0.65mm); LastUpdated: 4/5/2026 8:09:45 PM; Lifecycle Status: Active; Minimum Order: 1; Number of Terminations: 2; Operating Temperature: -55°C ~ 155°C; Package / Case: 0805 (2012 Metric); Packaging: TapeAndReel; PartId: 47580; Part Status: Active; Price: 0.13; Resistance: 30.1 kOhms; Series: RP73P, Holsworthy; Size / Dimension: 0.079" L x 0.049" W (2.00mm x 1.25mm); Supplier 1: DigiKey; Supplier Part Number 1: A110685CT-ND; Supplier Device Package: 0805; Tolerance: ±0.1%
R47 = AC0805FR-7W4K7L: RES 4.7K OHM 1% 1/4W 0805; Manufacturer: Yageo; Power (Watts): 0.25W, 1/4W; Temperature Coefficient: ±100ppm/°C; Part Number: AC0805FR-7W4K7L; Value: 4.7 kOhms; ComponentLink1Description: Datasheet; ComponentLink1URL: https://www.yageo.com/upload/media/product/productsearch/datasheet/rchip/PYu-AC_51_RoHS_L_9.pdf; ComponentLink2Description: DigiKey Link; ComponentLink2URL: https://www.digikey.com/en/products/detail/yageo/AC0805FR-7W4K7L/16989051; Composition: Thick Film; Device Package: 0805 (2012 Metric); Features: Automotive AEC-Q200, Moisture Resistant; Height - Seated (Max): 0.024" (0.60mm); LastUpdated: 4/5/2026 9:17:50 PM; Lifecycle Status: Active; Minimum Order: 1; Number of Terminations: 2; Operating Temperature: -55°C ~ 155°C; Package / Case: 0805 (2012 Metric); Packaging: TapeAndReel; PartId: 77750; Part Status: Active; Price: 0.01; Ratings: AEC-Q200; Resistance: 4.7 kOhms; Series: AC; Size / Dimension: 0.079" L x 0.049" W (2.00mm x 1.25mm); Supplier 1: DigiKey; Supplier Part Number 1: 13-AC0805FR-7W4K7LCT-ND; Supplier Device Package: 0805; Tolerance: ±1%
R49 = AC0805FR-7W3K3L: RES 3.3K OHM 1% 1/4W 0805; Manufacturer: Yageo; Power (Watts): 0.25W, 1/4W; Temperature Coefficient: ±100ppm/°C; Part Number: AC0805FR-7W3K3L; Value: 3.3 kOhms; ComponentLink1Description: Datasheet; ComponentLink1URL: https://www.yageo.com/upload/media/product/productsearch/datasheet/rchip/PYu-AC_51_RoHS_L_9.pdf; ComponentLink2Description: DigiKey Link; ComponentLink2URL: https://www.digikey.com/en/products/detail/yageo/AC0805FR-7W3K3L/16982191; Composition: Thick Film; Device Package: 0805 (2012 Metric); Features: Automotive AEC-Q200, Moisture Resistant; Height - Seated (Max): 0.024" (0.60mm); LastUpdated: 4/5/2026 9:17:50 PM; Lifecycle Status: Active; Minimum Order: 1; Number of Terminations: 2; Operating Temperature: -55°C ~ 155°C; Package / Case: 0805 (2012 Metric); Packaging: TapeAndReel; PartId: 76420; Part Status: Active; Price: 0.01; Ratings: AEC-Q200; Resistance: 3.3 kOhms; Series: AC; Size / Dimension: 0.079" L x 0.049" W (2.00mm x 1.25mm); Supplier 1: DigiKey; Supplier Part Number 1: 13-AC0805FR-7W3K3LCT-ND; Supplier Device Package: 0805; Tolerance: ±1%
U2 U5 U6 U8 U9 = TPS7A5701RTER: No Description Available; Mfr_Name: Texas Instruments; RefDes: RefDes; Type: Type
U3 = CMP-0395-00535-2: Single Output Low Noise LDO, 1.5 A, Fixed 3.3 V Output, 2.1 to 20 V Input, 4-pin SOT-223 (DCY), -40 to 125 degC, Green (RoHS & no Sb/Br); Manufacturer: Texas Instruments; Vout Adj(Min)(V): 3.3; Vin(Max)(V): 20; SubFamily: Single Channel LDO; Iq(Typ)(mA): 1; Iout(Max)(A): 1.5; Vin(Min)(V): 2.1; Vdo(Typ)(mV): 340; Accuracy(%): 3; ComponentLink2Description: Datasheet; PackageVersion: 4202506/B; PackageReference: DCY0004A; ComponentLink1Description: Manufacturer URL; Eco-Plan: Green (RoHS & no Sb/Br); ComponentLink1URL: http://www.ti.com/; Fixed Output Options(V): 3.3; ComponentLink2URL: http://www.ti.com/general/docs/lit/getliterature.tsp?genericPartNumber=TL1963A-33&fileType=pdf; Vout Adj(Max)(V): 3.3; PackageDescription: 4-Pin Plastic Small Outline, Body 3.5 x 6.5 mm, Pitch 2.3 mm; ComponentLink3URL: http://www.ti.com/litv/pdf/mpds094a; DatasheetVersion: SLVS719F; PartNumber: TL1963A-33DCYR; Code_JEDEC: TO-261; Mounting Technology: Surface Mount; ComponentLink3Description: Package Specification
U4 U7 = TPS54KC23RZRR: No Description Available; Mfr_Name: Texas Instruments; TYPE: TYPE; RefDes: RefDes
U21 = ICL7660SCBAZ-TDKR: Description; Manufacturer_Name: Renesas Electronics; Copyright: Copyright (C) 2026 Ultra Librarian. All rights reserved.; Manufacturer_Part_Number: ICL7660SCBAZ-TDKR; RefDes: RefDes; Type: Type
U31 = TPS7A3901DSCR: 150-mA, 33-V, low-noise, high-PSRR, dual-channel positive & negative low-dropout voltage regulator 10-WSON -40 to 125; Manufacturer_Name: Texas Instruments; TYPE: TYPE; RefDes: RefDes; Copyright: Copyright (C) 2025 Ultra Librarian. All rights reserved.; Manufacturer_Part_Number: TPS7A3901DSCR